# Altium schematic sheet Relay y salida analógica.SchDoc: Relay y lazo 4-20mA
size A4; Address1: Medidor de energia PROSER; Address2: MEI-300V; DocumentNumber: 6; Revision: 01; SheetNumber: 6; SheetTotal: 6
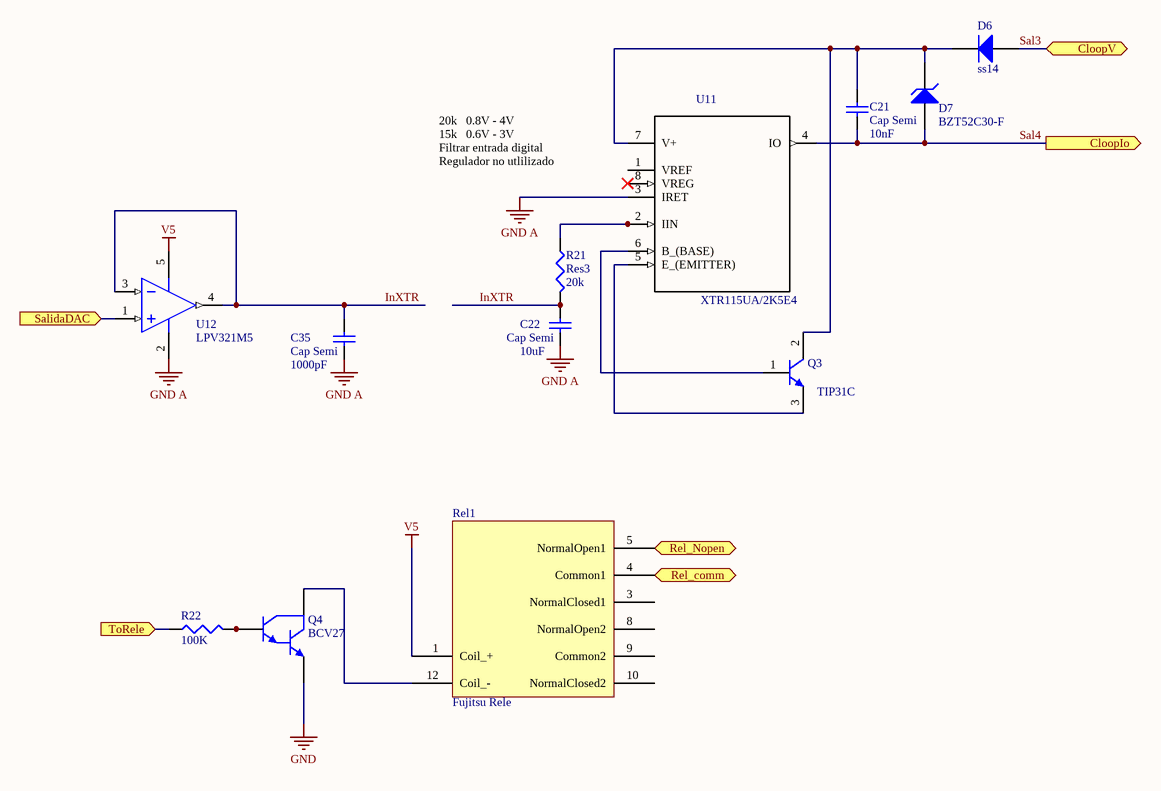
[diagram p0: Relay y salida analógica.SchDoc]

## Parts
C21  Cap Semi  value 10nF  [Custom0805]
C22  Cap Semi  value 10uF  [Custom0805]
C35  Cap Semi  value 1000pF  [Custom0805]
D6  ss14  [DO214]
D7  BZT52C30-F  [1N4148W]
Q3  TIP31C  [TO-220AB]
Q4  BCV27  [SOT23_L]
R21  Res3  value 20k  [Custom0805]
R22  value 100K  [Custom0805]  (hidden comment: Rb)
Rel1  Fujitsu Rele  [Rele_Fujtsu]
U11  XTR115UA/2K5E4  [*SOIC127P600X175-8N]
U12  LPV321M5  [MF05A_N]

## Ports
CloopIo (out), CloopV, Rel_comm (out), Rel_Nopen (out), SalidaDAC (in), ToRele (in)

## Nets
GND: Q4.2(E)
GND A: C22.1 C35.1 U11.3(IRET) U12.2(V-)
V5: Rel1.1(Coil_+) U12.5(V+)
InXTR: C22.2 C35.2 R21.2 U12.3(IN-) U12.4(OUT)
Rel_comm: Rel1.4(Common1) ; port Rel_comm
Rel_Nopen: Rel1.5(NormalOpen1) ; port Rel_Nopen
Sal3: D6.1(A) ; port CloopV
Sal4: C21.1 D7.1(A) U11.4(IO) ; port CloopIo
SalidaDAC: U12.1(IN+) ; port SalidaDAC
ToRele: R22.1 ; port ToRele
NetC21_2: C21.2 D6.2(K) D7.2(K) Q3.2(C) U11.7(V+)
NetQ3_1: Q3.1(B) U11.6(B_(BASE))
NetQ3_3: Q3.3(E) U11.5(E_(EMITTER))
NetQ4_1: Q4.1(C) Rel1.12(Coil_-)
NetQ4_3: Q4.3(B) R22.2
NetR21_1: R21.1 U11.2(IIN)

Not connected (* = marked no-connect by the designer): Rel1 3(NormalClosed1) 8(NormalOpen2) 9(Common2) 10(NormalClosed2); U11 1(VREF) 8(VREG)*

## Notes on the sheet
- 20k   0.8V - 4V
  15k   0.6V - 3V
  Filtrar entrada digital
  Regulador no utlilizado
- Title
- Size:
- Date:
- A4
- Number:
- Time:
- Revision:
- Sheet
- of
- File:

## Library data of the parts
C21 C22 C35 = Cap Semi: Capacitor (Semiconductor SIM Model); Published: 8-Jun-2000; LatestRevisionDate: 29-May-2009; LatestRevisionNote: IPC-7351 Footprint Added.; PackageReference: C1206; Publisher: Altium Limited; PackageDescription: Chip Capacitor
D6 = Diode: Default Diode; Published: 8-Jun-2000; LatestRevisionDate: 17-Jul-2002; LatestRevisionNote: Re-released for DXP Platform.; PackageVersion: Sep-1996; PackageReference: SMC; Publisher: Altium Limited; PackageDescription: DO-214-AB/SMC; 2 C-Bend Leads; Body 7.9 x 5.9 mm, inc. leads (LxW); Code_JEDEC: DO-214-AB
D7 = D Zener: Zener Diode SMD; Published: 8-Jun-2000; LatestRevisionDate: 17-Jul-2002; LatestRevisionNote: Re-released for DXP Platform.; PackageReference: DIODE-0.7; Publisher: Altium Limited; PackageDescription: Diode, Thru-Hole; 2 Leads; 0.7 in Pin Spacing
Q3 = NPN: NPN Bipolar Transistor; Published: 8-Jun-2000; LatestRevisionDate: 17-Jul-2002; LatestRevisionNote: Re-released for DXP Platform.; PackageReference: TO-226-AA; Publisher: Altium Limited; PackageDescription: TO, Flat Index; 3 In-Line, Axial Leads; Body Dia. 4.8mm; Leads 0.55 x 0.51 mm (max); Code_JEDEC: TO-226-AA
Q4 = NPN1: NPN Darlington Bipolar Transistor; Published: 8-Jun-2000; LatestRevisionDate: 17-Jul-2002; LatestRevisionNote: Re-released for DXP Platform.; DatasheetVersion: 1989; PackageVersion: 1989; PackageReference: TO-92; Publisher: Altium Limited; PackageDescription: TO, Flat Index; 3 In-Line, Axial Leads; Body Dia. 4.6mm; Leads 0.41 x 0.39 mm (max); Code_JEDEC: TO-92
R21 R22 = Res3: Resistor; Published: 8-Jun-2000; LatestRevisionDate: 29-May-2009; LatestRevisionNote: IPC-7351 Footprint Added.; PackageReference: J1-0603; Publisher: Altium Limited; PackageDescription: Chip Resistor
Rel1 = Rele_2: FBR12ND-05
U11 = XTR115UA/2K5E4: Current Loop Transmitter 8-Pin SOIC T/R; MF: Texas Instruments; MP: XTR115UA/2K5E4; Price: None; Availability: Unavailable; SnapEDA_Link: https://www.snapeda.com/parts/XTR115UA/2K5E4/Texas%20Instruments/view-part/?ref=snap; Package: None; Value: *
U12 = LPV321M5: General Purpose, Low Voltage, Low Power, Rail-to-Rail Output Operational Amplifiers, 5-pin SOT-23; Manufacturer: National Semiconductor; PackageTopMarking: A27A*XTT; PowerWise: Y; Published: 4-Dec-2008; LatestRevisionDate: 13-Jan-2009; LatestRevisionNote: Sim Model Added.; DatasheetVersion: Oct-2006; PackageVersion: revD, Aug-2008; PackageReference: MF05A; Publisher: Altium Limited; PackageDescription: Molded SOT-23, .115 x .063 x .040 in Body, 5 Lead, .0375 in Pitch; PartNumber: LPV321M5; RoHS: N; PinCount: 5; CompType: Amplifiers; ComponentLink1Description: LPV321 Datasheet; ComponentLink1URL: http://www.national.com/ds/LP/LPV321.pdf; ComponentLink2Description: LPV321 Web Page; ComponentLink2URL: http://www.national.com/pf/LP/LPV321.html; ComponentLink3Description: MF05A Package Page; ComponentLink3URL: http://www.national.com/packaging/folders/mf05a.html